# Altium project PCA_0006_Mini_CB_REV_B.PrjPcb
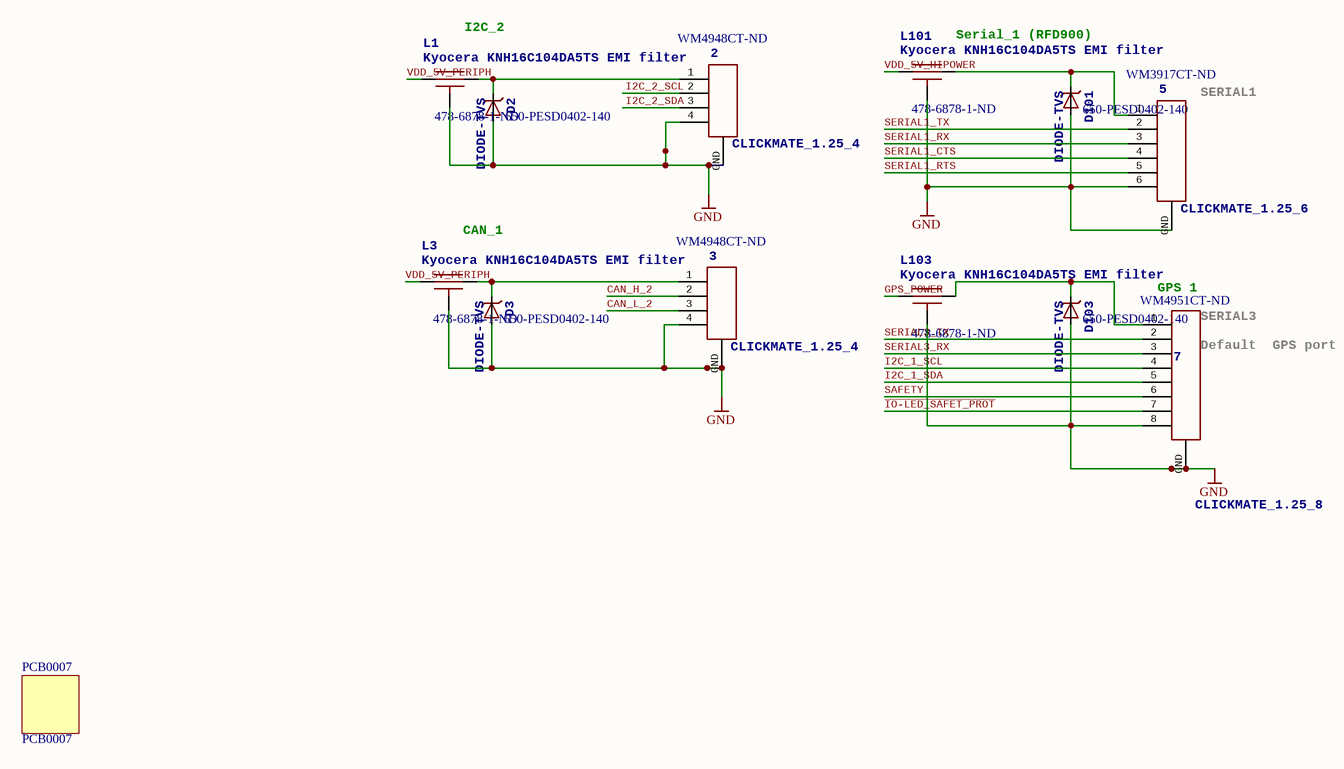
[diagram p0: PCA_0006_Mini_CB_Plugs_REV_B.SchDoc]
5 sheets, 28 parts. Net scope: global (net labels, ports and power ports of the same name join across sheets).
Board file: PCA_0006_Mini_CB_REV_B.PcbDoc
Sheets:
  PCA_0006_Mini_CB_Plugs_REV_B.SchDoc
  PCA_0006_Mini_CB_Power_REV_B.SchDoc
  PCA_0006_Mini_CB_Servo_REV_B.SchDoc
  PCA_0006_Mini_CB_Mech_REV_B.SchDoc
  PCA_0006_Mini_CB_80Pin_REV_B.SchDoc

## Sheet PCA_0006_Mini_CB_Plugs_REV_B.SchDoc
size A4; DrawnBy: Philip Rowse

### Parts
2  CLICKMATE_1.25_4  Supplier Part Number 1: WM4948CT-ND  [CLICKMATE_H4]
3  CLICKMATE_1.25_4  Supplier Part Number 1: WM4948CT-ND  [CLICKMATE_H4]
5  CLICKMATE_1.25_6  Supplier Part Number 1: WM3917CT-ND  [CLICKMATE_H6]
7  CLICKMATE_1.25_8  Supplier Part Number 1: WM4951CT-ND  [CLICKMATE_H8]
D2  DIODE-TVS  Supplier Part Number 1: 650-PESD0402-140  [0402-TVS]
D3  DIODE-TVS  Supplier Part Number 1: 650-PESD0402-140  [0402-TVS]
D101  DIODE-TVS  Supplier Part Number 1: 650-PESD0402-140  [0402-TVS]
D103  DIODE-TVS  Supplier Part Number 1: 650-PESD0402-140  [0402-TVS]
L1  Kyocera KNH16C104DA5TS EMI filter  Supplier Part Number 1: 478-6878-1-ND  [KYOCERA-KNH16-DA]
L3  Kyocera KNH16C104DA5TS EMI filter  Supplier Part Number 1: 478-6878-1-ND  [KYOCERA-KNH16-DA]
L101  Kyocera KNH16C104DA5TS EMI filter  Supplier Part Number 1: 478-6878-1-ND  [KYOCERA-KNH16-DA]
L103  Kyocera KNH16C104DA5TS EMI filter  Supplier Part Number 1: 478-6878-1-ND  [KYOCERA-KNH16-DA]
PCB0007  PCB0007

### Nets
GND: 2.4 2.GND 3.4 3.GND 5.6 5.GND 7.8 7.GND D2.A D3.A D101.A D103.A L1.GND L3.GND L101.GND L103.GND
CAN_H_2: 3.2
CAN_L_2: 3.3
GPS_POWER: L1.P$1 L3.P$1 L103.P$1  [also labelled VDD_5V_PERIPH]
I2C_1_SCL: 7.4
I2C_1_SDA: 7.5
I2C_2_SCL: 2.2
I2C_2_SDA: 2.3
~{IO-LED_SAFET_PROT}: 7.7
SAFETY: 7.6
SERIAL1_CTS: 5.4
SERIAL1_RTS: 5.5
SERIAL1_RX: 5.3
SERIAL1_TX: 5.2
SERIAL3_RX: 7.3
SERIAL3_TX: 7.2
VDD_5V_HIPOWER: L101.P$1
Net2_1: 2.1 D2.C L1.P$2
Net3_1: 3.1 D3.C L3.P$2
Net5_1: 5.1 D101.C L101.P$2
Net7_1: 7.1 D103.C L103.P$2

### Notes on the sheet
- (near L1) I2C_2
- (near L101) Serial_1 (RFD900)
- (near 5) SERIAL1
- (near L3) CAN_1
- (near 7) GPS 1
- (near 7) SERIAL3
- (near 7) Default
  GPS port
- This licence Applies to this doccument ONLY, other components that make up the full system come with their own licences, please check with the Author for further information
- To the extent possible under law, Philip Rowse and 3DRobotics has waived all copyright and related or neighboring
- rights to Carrier board for APM 3.0 series. This work is published from: United States, and Australia
- Title:
- Date:
- Time:
- For information on this Licence: http://creativecommons.org/publicdomain/zero/1.0/
- Sheet:
- Approved:
- of:
- Drawn By:
- Checked By:
- 3DRobotics

### Library data of the parts
2 3 = CLICKMATE_1.25_4: Connector, Receptacle, 4Pos, 1.25MM, R/A, SMD, Tin; 3DR_PARTNO: ECM0531; Supplier 1: Digi-Key
5 = CLICKMATE_1.25_6: 1.25 W/B SGL R/A REC ASSY 6CKT; 3DR_PARTNO: ECM0532; Supplier 1: Digi-Key
7 = CLICKMATE_1.25_8: Connector, Receptacle, 8Pos, 1.25MM, R/A, SMD, Tin; 3DR_PARTNO: ECM0533; Supplier 1: Digi-Key
D2 D3 D101 D103 = DIODE-TVS: Diode, TVS, 14VWM, 40VC, 0402, SMD; 3DR_PARTNO: ECM0837; Supplier 1: Mouser
L1 L3 L101 L103 = KNH16C104DA5TS: Capacitor, Filter, 0.1uF, 25V, 2A, 0603, SMD; 3DR_PARTNO: ECM0719; Supplier 1: Digi-Key
PCB0007 = PCB_0007: PCB, Carrier Mini, PX2, Board; 3DR_PARTNO: PCB0007; Value: PCB0007

## Sheet PCA_0006_Mini_CB_Power_REV_B.SchDoc
size A4; DrawnBy: Philip Rowse
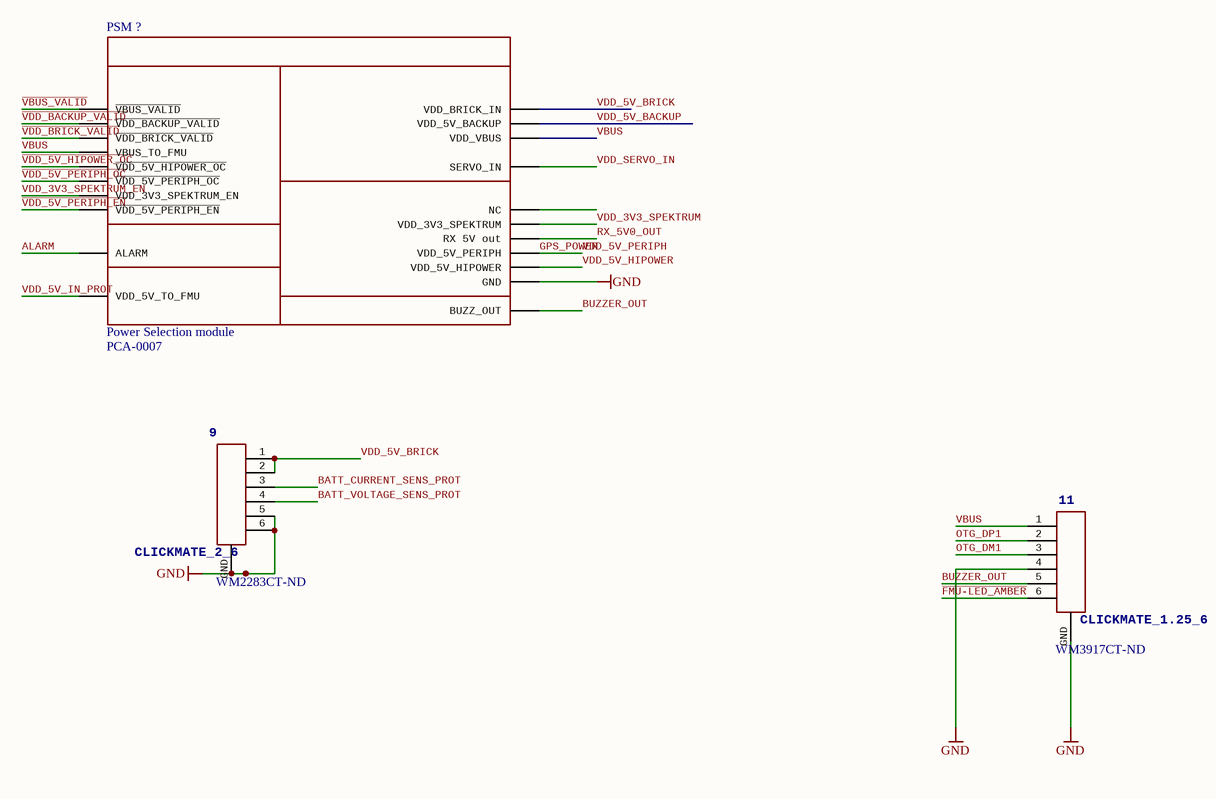
[diagram p1: PCA_0006_Mini_CB_Power_REV_B.SchDoc]

### Parts
9  CLICKMATE_2_6  Supplier Part Number 1: WM2283CT-ND  [CLICKMATE_H6_2MM]
11  CLICKMATE_1.25_6  Supplier Part Number 1: WM3917CT-ND  [CLICKMATE_H6]
PSM_?  Power Selection module  Supplier Part Number 1: PCA-0007  [PSM]

### Nets
GND: 9.5 9.6 9.GND 11.4 11.GND PSM_?.GND
ALARM: PSM_?.ALARM
BATT_CURRENT_SENS_PROT: 9.3
BATT_VOLTAGE_SENS_PROT: 9.4
BUZZER_OUT: 11.5 PSM_?.BUZZER_OUT(BUZZ_OUT)
~{FMU-LED_AMBER}: 11.6
GPS_POWER: PSM_?.5V_PERIPH(VDD_5V_PERIPH)  [also labelled VDD_5V_PERIPH]
OTG_DM1: 11.3
OTG_DP1: 11.2
RX_5V0_OUT: PSM_?.RX(RX_5V_out)
~{VBUS_VALID}: PSM_?.!VBUS_VALID(~{VBUS_VALID})
~{VDD_5V_HIPOWER_OC}: PSM_?.!VDD_5V_HIPOWER_OC(~{VDD_5V_HIPOWER_OC})
~{VDD_5V_PERIPH_EN}: PSM_?.!VDD_5V_PERIPH_EN(~{VDD_5V_PERIPH_EN})
~{VDD_5V_PERIPH_OC}: PSM_?.!VDD_5V_PERIPH_OC(~{VDD_5V_PERIPH_OC})
~{VDD_BACKUP_VALID}: PSM_?.!VDD_BACKUP_VALID(~{VDD_BACKUP_VALID})
~{VDD_BRICK_VALID}: PSM_?.!VDD_BRICK_VALID(~{VDD_BRICK_VALID})
VBUS: 11.1 PSM_?.VBUS(VBUS_TO_FMU) PSM_?.VDD_VBUS
VDD_3V3_SPEKTRUM: PSM_?.SPEK(VDD_3V3_SPEKTRUM)
VDD_3V3_SPEKTRUM_EN: PSM_?.VDD_3V3_SPEKTRUM_EN
VDD_5V_BACKUP: PSM_?.VDD_5V_BACKUP
VDD_5V_BRICK: 9.1 9.2 PSM_?.VDD_BRICK_IN
VDD_5V_HIPOWER: PSM_?.5V_HIPOWER(VDD_5V_HIPOWER)
VDD_5V_IN_PROT: PSM_?.VDD_5V_IN_PROT(VDD_5V_TO_FMU)
VDD_SERVO_IN: PSM_?.SERVO_IN

Not connected (* = marked no-connect by the designer): PSM_? NC

### Notes on the sheet
- This licence Applies to this doccument ONLY, other components that make up the full system come with their own licences, please check with the Author for further information
- To the extent possible under law, Philip Rowse and 3DRobotics has waived all copyright and related or neighboring
- rights to Carrier board for APM 3.0 series. This work is published from: United States, and Australia
- Title:
- Date:
- Time:
- For information on this Licence: http://creativecommons.org/publicdomain/zero/1.0/
- Sheet:
- Approved:
- of:
- Drawn By:
- Checked By:
- 3DRobotics

### Library data of the parts
9 = CLICKMATE_2_6: Connector, Receptacle, 6Pos, 2.00MM, R/A, PCB, Tin; 3DR_PARTNO: ECM0534; Supplier 1: Digi-Key
11 = CLICKMATE_1.25_6: as 5 on sheet PCA_0006_Mini_CB_Plugs_REV_B; Supplier 1: Digi-Key
PSM_? = PSMPSM: PCA, PSM, PX4, Assembly; Manufacturer 1: 3DR; Mfg Part Num (Alternate): DO NOT SWAP; 3DR_PARTNO: PCA0007; Manufacturer Part Number 1: PCA-0007; Supplier 1: 3DR; Supplier Unit Price 1: 17; Supplier Currency 1: USD; Supplier Order Qty 1: 100

## Sheet PCA_0006_Mini_CB_Servo_REV_B.SchDoc
size A4; DrawnBy: Philip Rowse
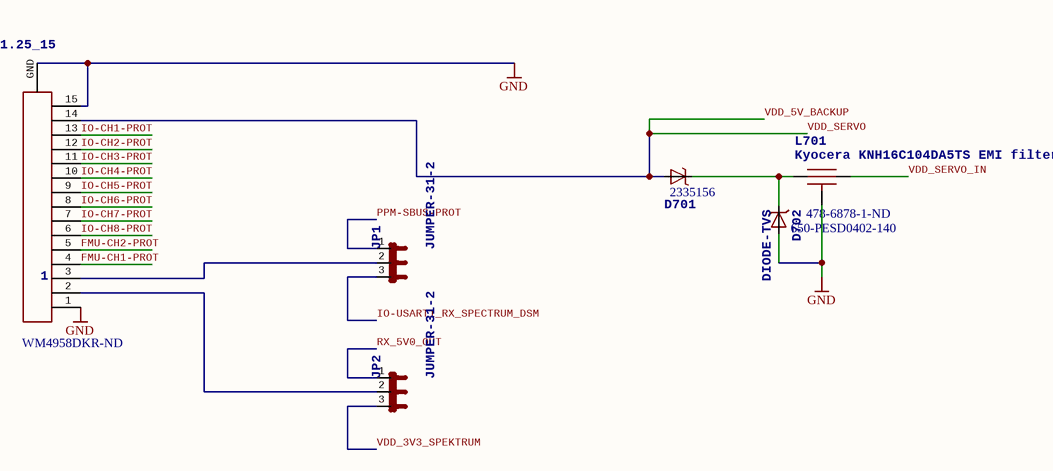
[diagram p2: PCA_0006_Mini_CB_Servo_REV_B.SchDoc]

### Parts
1  CLICKMATE_1.25_15  Supplier Part Number 1: WM4958DKR-ND  [CLICKMATE_H15]
D701  Supplier Part Number 1: 2335156  [MICROSMP]  (hidden comment: Schottky barrier diode in DO214AC, e.g. Fairchild SS14.)
D702  DIODE-TVS  Supplier Part Number 1: 650-PESD0402-140  [0402-TVS]
JP1  JUMPER-31-2  [SJ_3_PASTE1&2]
JP2  JUMPER-31-2  [SJ_3_PASTE1&2]
L701  Kyocera KNH16C104DA5TS EMI filter  Supplier Part Number 1: 478-6878-1-ND  [KYOCERA-KNH16-DA]

### Nets
GND: 1.1 1.15 1.GND D702.A L701.GND
FMU-CH1-PROT: 1.4
FMU-CH2-PROT: 1.5
IO-CH1-PROT: 1.13
IO-CH2-PROT: 1.12
IO-CH3-PROT: 1.11
IO-CH4-PROT: 1.10
IO-CH5-PROT: 1.9
IO-CH6-PROT: 1.8
IO-CH7-PROT: 1.7
IO-CH8-PROT: 1.6
IO-USART1_RX_SPECTRUM_DSM: JP1.3
PPM-SBUS-PROT: JP1.1
RX_5V0_OUT: JP2.1
VDD_3V3_SPEKTRUM: JP2.3
VDD_5V_BACKUP: 1.14 D701.ANODE(A)  [also labelled VDD_SERVO]
VDD_SERVO_IN: L701.P$2
Net1_2: 1.2 JP2.2
Net1_3: 1.3 JP1.2
NetD701_CATHODE: D701.CATHODE(C) D702.C L701.P$1

### Notes on the sheet
- This licence Applies to this doccument ONLY, other components that make up the full system come with their own licences, please check with the Author for further information
- To the extent possible under law, Philip Rowse and 3DRobotics has waived all copyright and related or neighboring
- rights to Carrier board for APM 3.0 series. This work is published from: United States, and Australia
- Title:
- Date:
- Time:
- For information on this Licence: http://creativecommons.org/publicdomain/zero/1.0/
- Sheet:
- Approved:
- of:
- Drawn By:
- Checked By:
- 3DRobotics

### Library data of the parts
1 = CLICKMATE_1.25_15: Connector, Receptacle, 15Pos, 1.25MM, R/A, SMD, Tin; 3DR_PARTNO: ECM0530; Supplier 1: Digi-Key
D701 = DIODE-SCHOTTKY_MSMP: Diode, Schottky, 40V, 1A, MicroSMP, SMD; partnumber: MSS1P4-M3/89A; 3DR_PARTNO: ECM0900; man: vishay; Supplier 1: Farnell
D702 = DIODE-TVS: as D2 on sheet PCA_0006_Mini_CB_Plugs_REV_B; Supplier 1: Mouser
JP1 JP2 = JUMPER-31-2: DO NOT FIT
L701 = KNH16C104DA5TS: as L1 on sheet PCA_0006_Mini_CB_Plugs_REV_B; Supplier 1: Digi-Key

## Sheet PCA_0006_Mini_CB_Mech_REV_B.SchDoc
size A4; DrawnBy: Philip Rowse
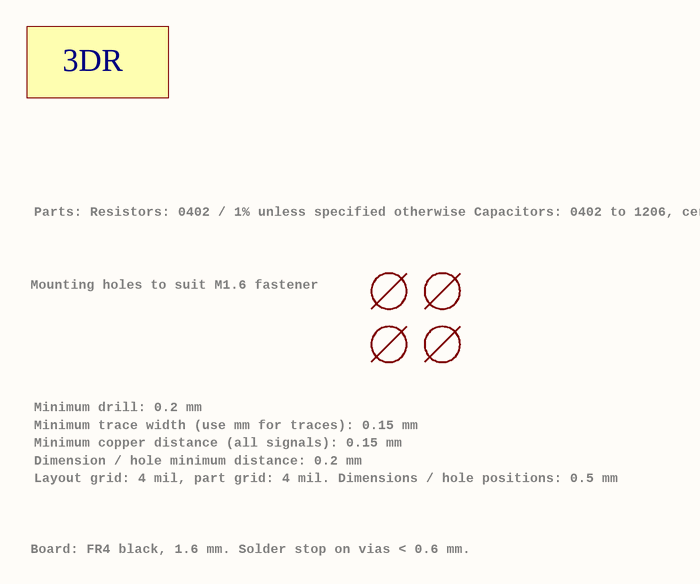
[diagram p3: PCA_0006_Mini_CB_Mech_REV_B.SchDoc]

### Parts
LOGO_3DR  DO NOT FIT  [3DR_SMALL]  (value not drawn)
M3_MOUNT901  MOUNT-HOLE1.8MM  [MOUNT-HOLE1.8]  (value not drawn)
M3_MOUNT902  MOUNT-HOLE1.8MM  [MOUNT-HOLE1.8]  (value not drawn)
M3_MOUNT903  MOUNT-HOLE1.8MM  [MOUNT-HOLE1.8]  (value not drawn)
M3_MOUNT904  MOUNT-HOLE1.8MM  [MOUNT-HOLE1.8]  (value not drawn)

### Notes on the sheet
- Parts:
  Resistors: 0402 / 1% unless specified otherwise
  Capacitors: 0402 to 1206, ceramic, voltage rating: 10V unless specified
- Mounting holes to suit M1.6 fastener
- Minimum drill: 0.2 mm
- Minimum trace width (use mm for traces): 0.15 mm
- Minimum copper distance (all signals): 0.15 mm
- Dimension / hole minimum distance: 0.2 mm
- Layout grid: 4 mil, part grid: 4 mil. Dimensions / hole positions: 0.5 mm
- Board: FR4 black, 1.6 mm. Solder stop on vias < 0.6 mm.
- This licence Applies to this doccument ONLY, other components that make up the full system come with their own licences, please check with the Author for further information
- To the extent possible under law, Philip Rowse and 3DRobotics has waived all copyright and related or neighboring
- rights to Carrier board for APM 3.0 series. This work is published from: United States, and Australia
- Title:
- Date:
- Time:
- For information on this Licence: http://creativecommons.org/publicdomain/zero/1.0/
- Sheet:
- Approved:
- of:
- Drawn By:
- Checked By:
- 3DRobotics
- (in symbol 3DR Logo) 3DR

### Library data of the parts
LOGO_3DR = 3DR Logo
M3_MOUNT901-M3_MOUNT904 = MOUNT-HOLE1.8MM: DO NOT FIT

## Sheet PCA_0006_Mini_CB_80Pin_REV_B.SchDoc
size A4; DrawnBy: Philip Rowse
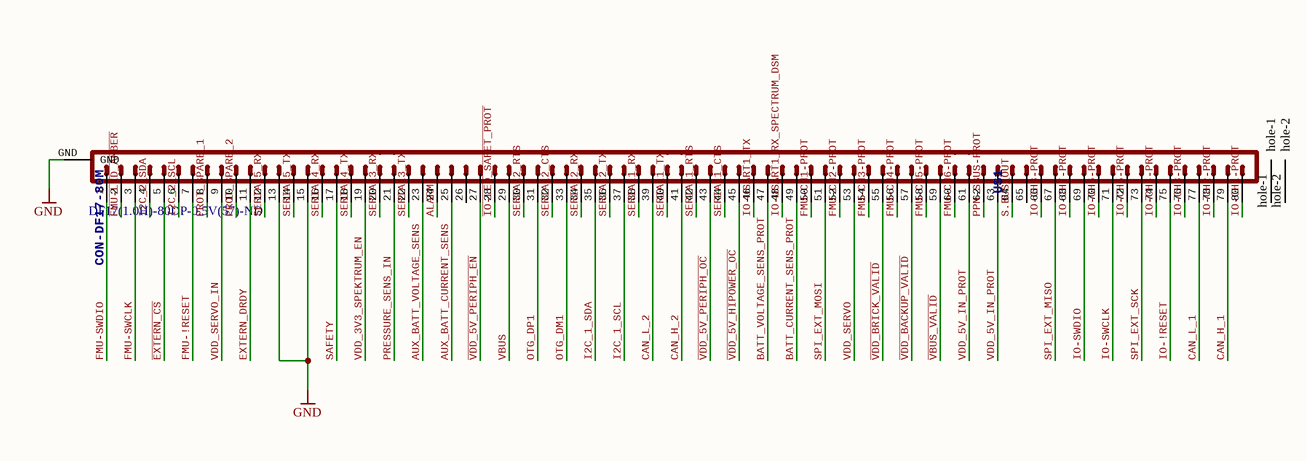
[diagram p4: PCA_0006_Mini_CB_80Pin_REV_B.SchDoc]

### Parts
U$1  CON-DF17-80M  Supplier Part Number 1: DF17(1.0H)-80DP-0.5V(57)-ND  [CON-DF17-80M]

### Nets
GND: U$1.13 U$1.15 U$1.GND
ALARM: U$1.24
AUX_BATT_CURRENT_SENS: U$1.25
AUX_BATT_VOLTAGE_SENS: U$1.23
BATT_CURRENT_SENS_PROT: U$1.49
BATT_VOLTAGE_SENS_PROT: U$1.47
CAN_H_1: U$1.79
CAN_H_2: U$1.41
CAN_L_1: U$1.77
CAN_L_2: U$1.39
~{EXTERN_CS}: U$1.5
EXTERN_DRDY: U$1.11
~{FMU-LED_AMBER}: U$1.2
FMU-!RESET: U$1.7
FMU-CH1-PROT: U$1.50
FMU-CH2-PROT: U$1.52
FMU-CH3-PROT: U$1.54
FMU-CH4-PROT: U$1.56
FMU-CH5-PROT: U$1.58
FMU-CH6-PROT: U$1.60
FMU-SWCLK: U$1.3
FMU-SWDIO: U$1.1
I2C_1_SCL: U$1.37
I2C_1_SDA: U$1.35
I2C_2_SCL: U$1.6
I2C_2_SDA: U$1.4
~{IO-LED_SAFET_PROT}: U$1.28
IO-!RESET: U$1.75
IO-CH1-PROT: U$1.80
IO-CH2-PROT: U$1.78
IO-CH3-PROT: U$1.76
IO-CH4-PROT: U$1.74
IO-CH5-PROT: U$1.72
IO-CH6-PROT: U$1.70
IO-CH7-PROT: U$1.68
IO-CH8-PROT: U$1.66
IO-SWCLK: U$1.71
IO-SWDIO: U$1.69
IO-USART1_RX_SPECTRUM_DSM: U$1.48
IO-USART1_TX: U$1.46
OTG_DM1: U$1.33
OTG_DP1: U$1.31
PPM-SBUS-PROT: U$1.62
PRESSURE_SENS_IN: U$1.21
PROT_SPARE_1: U$1.8
PROT_SPARE_2: U$1.10
S.BUS_OUT: U$1.64
SAFETY: U$1.17
SERIAL1_CTS: U$1.44
SERIAL1_RTS: U$1.42
SERIAL1_RX: U$1.38
SERIAL1_TX: U$1.40
SERIAL2_CTS: U$1.32
SERIAL2_RTS: U$1.30
SERIAL2_RX: U$1.34
SERIAL2_TX: U$1.36
SERIAL3_RX: U$1.20
SERIAL3_TX: U$1.22
SERIAL4_RX: U$1.16
SERIAL4_TX: U$1.18
SERIAL5_RX: U$1.12
SERIAL5_TX: U$1.14
SPI_EXT_MISO: U$1.67
SPI_EXT_MOSI: U$1.51
SPI_EXT_SCK: U$1.73
~{VBUS_VALID}: U$1.59
~{VDD_5V_HIPOWER_OC}: U$1.45
~{VDD_5V_PERIPH_EN}: U$1.27
~{VDD_5V_PERIPH_OC}: U$1.43
~{VDD_BACKUP_VALID}: U$1.57
~{VDD_BRICK_VALID}: U$1.55
VBUS: U$1.29
VDD_3V3_SPEKTRUM_EN: U$1.19
VDD_5V_IN_PROT: U$1.61 U$1.63
VDD_SERVO: U$1.53  [project net VDD_5V_BACKUP]
VDD_SERVO_IN: U$1.9

Not connected (* = marked no-connect by the designer): U$1 26 65 hole-1 hole-2

### Notes on the sheet
- This licence Applies to this doccument ONLY, other components that make up the full system come with their own licences, please check with the Author for further information
- To the extent possible under law, Philip Rowse and 3DRobotics has waived all copyright and related or neighboring
- rights to Carrier board for APM 3.0 series. This work is published from: United States, and Australia
- Title:
- Date:
- Time:
- For information on this Licence: http://creativecommons.org/publicdomain/zero/1.0/
- Sheet:
- Approved:
- of:
- Drawn By:
- Checked By:
- 3DRobotics

### Library data of the parts
U$1 = CON-DF17-80M: Connector, Header, 80Pos, .5MM, DUAL, SMD, Au; 3DR_PARTNO: ECM0528; Supplier 1: Digi-Key

## Nets that join several sheets
GND: PCA_0006_Mini_CB_Plugs_REV_B (16 pins), PCA_0006_Mini_CB_Power_REV_B (6 pins), PCA_0006_Mini_CB_Servo_REV_B (5 pins), PCA_0006_Mini_CB_80Pin_REV_B (U$1.13 U$1.15 U$1.GND)
ALARM: PCA_0006_Mini_CB_Power_REV_B (PSM_?.ALARM), PCA_0006_Mini_CB_80Pin_REV_B (U$1.24)
BATT_CURRENT_SENS_PROT: PCA_0006_Mini_CB_Power_REV_B (9.3), PCA_0006_Mini_CB_80Pin_REV_B (U$1.49)
BATT_VOLTAGE_SENS_PROT: PCA_0006_Mini_CB_Power_REV_B (9.4), PCA_0006_Mini_CB_80Pin_REV_B (U$1.47)
CAN_H_2: PCA_0006_Mini_CB_Plugs_REV_B (3.2), PCA_0006_Mini_CB_80Pin_REV_B (U$1.41)
CAN_L_2: PCA_0006_Mini_CB_Plugs_REV_B (3.3), PCA_0006_Mini_CB_80Pin_REV_B (U$1.39)
~{FMU-LED_AMBER}: PCA_0006_Mini_CB_Power_REV_B (11.6), PCA_0006_Mini_CB_80Pin_REV_B (U$1.2)
FMU-CH1-PROT: PCA_0006_Mini_CB_Servo_REV_B (1.4), PCA_0006_Mini_CB_80Pin_REV_B (U$1.50)
FMU-CH2-PROT: PCA_0006_Mini_CB_Servo_REV_B (1.5), PCA_0006_Mini_CB_80Pin_REV_B (U$1.52)
GPS_POWER: PCA_0006_Mini_CB_Plugs_REV_B (L1.P$1 L3.P$1 L103.P$1), PCA_0006_Mini_CB_Power_REV_B (PSM_?.5V_PERIPH)
I2C_1_SCL: PCA_0006_Mini_CB_Plugs_REV_B (7.4), PCA_0006_Mini_CB_80Pin_REV_B (U$1.37)
I2C_1_SDA: PCA_0006_Mini_CB_Plugs_REV_B (7.5), PCA_0006_Mini_CB_80Pin_REV_B (U$1.35)
I2C_2_SCL: PCA_0006_Mini_CB_Plugs_REV_B (2.2), PCA_0006_Mini_CB_80Pin_REV_B (U$1.6)
I2C_2_SDA: PCA_0006_Mini_CB_Plugs_REV_B (2.3), PCA_0006_Mini_CB_80Pin_REV_B (U$1.4)
~{IO-LED_SAFET_PROT}: PCA_0006_Mini_CB_Plugs_REV_B (7.7), PCA_0006_Mini_CB_80Pin_REV_B (U$1.28)
IO-CH1-PROT: PCA_0006_Mini_CB_Servo_REV_B (1.13), PCA_0006_Mini_CB_80Pin_REV_B (U$1.80)
IO-CH2-PROT: PCA_0006_Mini_CB_Servo_REV_B (1.12), PCA_0006_Mini_CB_80Pin_REV_B (U$1.78)
IO-CH3-PROT: PCA_0006_Mini_CB_Servo_REV_B (1.11), PCA_0006_Mini_CB_80Pin_REV_B (U$1.76)
IO-CH4-PROT: PCA_0006_Mini_CB_Servo_REV_B (1.10), PCA_0006_Mini_CB_80Pin_REV_B (U$1.74)
IO-CH5-PROT: PCA_0006_Mini_CB_Servo_REV_B (1.9), PCA_0006_Mini_CB_80Pin_REV_B (U$1.72)
IO-CH6-PROT: PCA_0006_Mini_CB_Servo_REV_B (1.8), PCA_0006_Mini_CB_80Pin_REV_B (U$1.70)
IO-CH7-PROT: PCA_0006_Mini_CB_Servo_REV_B (1.7), PCA_0006_Mini_CB_80Pin_REV_B (U$1.68)
IO-CH8-PROT: PCA_0006_Mini_CB_Servo_REV_B (1.6), PCA_0006_Mini_CB_80Pin_REV_B (U$1.66)
IO-USART1_RX_SPECTRUM_DSM: PCA_0006_Mini_CB_Servo_REV_B (JP1.3), PCA_0006_Mini_CB_80Pin_REV_B (U$1.48)
OTG_DM1: PCA_0006_Mini_CB_Power_REV_B (11.3), PCA_0006_Mini_CB_80Pin_REV_B (U$1.33)
OTG_DP1: PCA_0006_Mini_CB_Power_REV_B (11.2), PCA_0006_Mini_CB_80Pin_REV_B (U$1.31)
PPM-SBUS-PROT: PCA_0006_Mini_CB_Servo_REV_B (JP1.1), PCA_0006_Mini_CB_80Pin_REV_B (U$1.62)
RX_5V0_OUT: PCA_0006_Mini_CB_Power_REV_B (PSM_?.RX), PCA_0006_Mini_CB_Servo_REV_B (JP2.1)
SAFETY: PCA_0006_Mini_CB_Plugs_REV_B (7.6), PCA_0006_Mini_CB_80Pin_REV_B (U$1.17)
SERIAL1_CTS: PCA_0006_Mini_CB_Plugs_REV_B (5.4), PCA_0006_Mini_CB_80Pin_REV_B (U$1.44)
SERIAL1_RTS: PCA_0006_Mini_CB_Plugs_REV_B (5.5), PCA_0006_Mini_CB_80Pin_REV_B (U$1.42)
SERIAL1_RX: PCA_0006_Mini_CB_Plugs_REV_B (5.3), PCA_0006_Mini_CB_80Pin_REV_B (U$1.38)
SERIAL1_TX: PCA_0006_Mini_CB_Plugs_REV_B (5.2), PCA_0006_Mini_CB_80Pin_REV_B (U$1.40)
SERIAL3_RX: PCA_0006_Mini_CB_Plugs_REV_B (7.3), PCA_0006_Mini_CB_80Pin_REV_B (U$1.20)
SERIAL3_TX: PCA_0006_Mini_CB_Plugs_REV_B (7.2), PCA_0006_Mini_CB_80Pin_REV_B (U$1.22)
~{VBUS_VALID}: PCA_0006_Mini_CB_Power_REV_B (PSM_?.!VBUS_VALID), PCA_0006_Mini_CB_80Pin_REV_B (U$1.59)
~{VDD_5V_HIPOWER_OC}: PCA_0006_Mini_CB_Power_REV_B (PSM_?.!VDD_5V_HIPOWER_OC), PCA_0006_Mini_CB_80Pin_REV_B (U$1.45)
~{VDD_5V_PERIPH_EN}: PCA_0006_Mini_CB_Power_REV_B (PSM_?.!VDD_5V_PERIPH_EN), PCA_0006_Mini_CB_80Pin_REV_B (U$1.27)
~{VDD_5V_PERIPH_OC}: PCA_0006_Mini_CB_Power_REV_B (PSM_?.!VDD_5V_PERIPH_OC), PCA_0006_Mini_CB_80Pin_REV_B (U$1.43)
~{VDD_BACKUP_VALID}: PCA_0006_Mini_CB_Power_REV_B (PSM_?.!VDD_BACKUP_VALID), PCA_0006_Mini_CB_80Pin_REV_B (U$1.57)
~{VDD_BRICK_VALID}: PCA_0006_Mini_CB_Power_REV_B (PSM_?.!VDD_BRICK_VALID), PCA_0006_Mini_CB_80Pin_REV_B (U$1.55)
VBUS: PCA_0006_Mini_CB_Power_REV_B (11.1 PSM_?.VBUS PSM_?.VDD_VBUS), PCA_0006_Mini_CB_80Pin_REV_B (U$1.29)
VDD_3V3_SPEKTRUM: PCA_0006_Mini_CB_Power_REV_B (PSM_?.SPEK), PCA_0006_Mini_CB_Servo_REV_B (JP2.3)
VDD_3V3_SPEKTRUM_EN: PCA_0006_Mini_CB_Power_REV_B (PSM_?.VDD_3V3_SPEKTRUM_EN), PCA_0006_Mini_CB_80Pin_REV_B (U$1.19)
VDD_5V_BACKUP: PCA_0006_Mini_CB_Power_REV_B (PSM_?.VDD_5V_BACKUP), PCA_0006_Mini_CB_Servo_REV_B (1.14 D701.ANODE), PCA_0006_Mini_CB_80Pin_REV_B (U$1.53)
VDD_5V_HIPOWER: PCA_0006_Mini_CB_Plugs_REV_B (L101.P$1), PCA_0006_Mini_CB_Power_REV_B (PSM_?.5V_HIPOWER)
VDD_5V_IN_PROT: PCA_0006_Mini_CB_Power_REV_B (PSM_?.VDD_5V_IN_PROT), PCA_0006_Mini_CB_80Pin_REV_B (U$1.61 U$1.63)
VDD_SERVO_IN: PCA_0006_Mini_CB_Power_REV_B (PSM_?.SERVO_IN), PCA_0006_Mini_CB_Servo_REV_B (L701.P$2), PCA_0006_Mini_CB_80Pin_REV_B (U$1.9)

## Assembly variants
PCA_0006_Mini_CB: not fitted JP1 JP2 LOGO 3DR M3_MOUNT901 M3_MOUNT902 M3_MOUNT903 M3_MOUNT904